# Altium schematic sheet MCU.SchDoc
size A; SheetNumber: 5; SheetTotal: 5
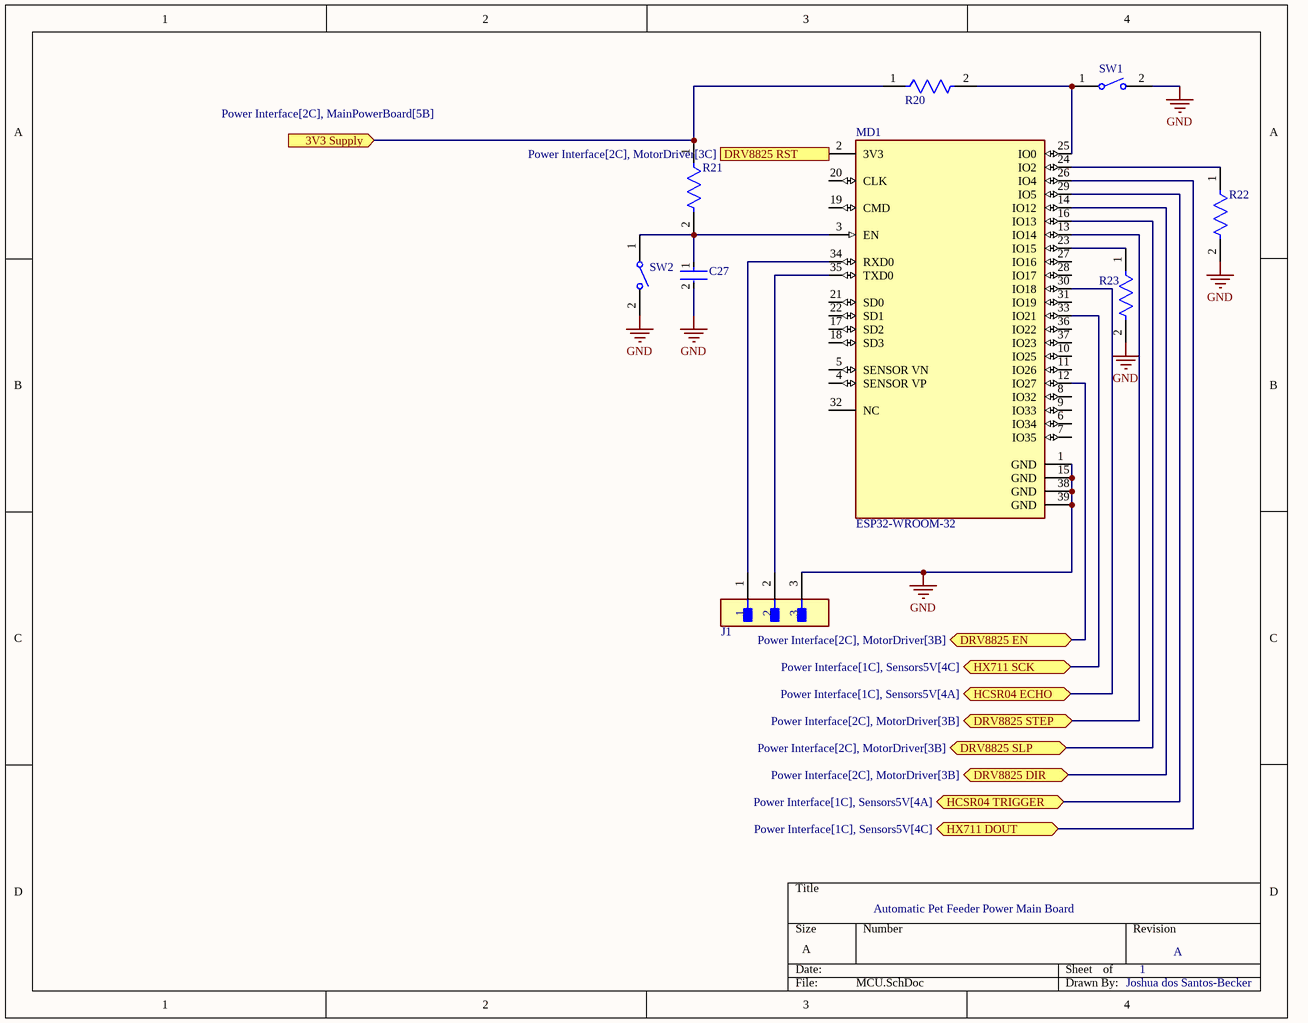
[diagram p0: MCU.SchDoc]

## Parts
C27  08055C104J4T2A  [FP-0805-L_2_01_0_2-W_1_25-MFG]  (value not drawn)
J1  PREC003SAAN-RC  [FP-PREC003SAAN-RC-MFG]  (value not drawn)
MD1  ESP32-WROOM-32  [FP-ESP32-WROOM-32-MFG]
R20  ESR10EZPD1002  [FP-ESR10-IPC_C]  (value not drawn)
R21  ESR10EZPD1002  [FP-ESR10-IPC_C]  (value not drawn)
R22  ESR10EZPD1002  [FP-ESR10-IPC_C]  (value not drawn)
R23  ESR10EZPD1002  [FP-ESR10-IPC_C]  (value not drawn)
SW1  FSMSM  [TECO-FSMSM-2_V]  (value not drawn)
SW2  FSMSM  [TECO-FSMSM-2_V]  (value not drawn)

## Ports
3V3 Supply (in, see Power Interface[2C], MainPowerBoard[5B]), DRV8825 DIR (bidir, see Power Interface[2C], MotorDriver[3B]), DRV8825 EN (bidir, see Power Interface[2C], MotorDriver[3B]), DRV8825 RST (see Power Interface[2C], MotorDriver[3C]), DRV8825 SLP (bidir, see Power Interface[2C], MotorDriver[3B]), DRV8825 STEP (bidir, see Power Interface[2C], MotorDriver[3B]), HCSR04 ECHO (bidir, see Power Interface[1C], Sensors5V[4A]), HCSR04 TRIGGER (bidir, see Power Interface[1C], Sensors5V[4A]), HX711 DOUT (bidir, see Power Interface[1C], Sensors5V[4C]), HX711 SCK (bidir, see Power Interface[1C], Sensors5V[4C])

## Nets
GND: C27.2 J1.3 MD1.1(GND) MD1.15(GND) MD1.38(GND) MD1.39(GND) R22.2 R23.2 SW1.2 SW2.2
3V3 Supply: R20.1 R21.1 ; port 3V3 Supply
DRV8825 DIR: MD1.14(IO12) ; port DRV8825 DIR
DRV8825 EN: MD1.12(IO27) ; port DRV8825 EN
DRV8825 RST: MD1.2(3V3) ; port DRV8825 RST
DRV8825 SLP: MD1.16(IO13) ; port DRV8825 SLP
DRV8825 STEP: MD1.13(IO14) ; port DRV8825 STEP
HCSR04 ECHO: MD1.30(IO18) ; port HCSR04 ECHO
HCSR04 TRIGGER: MD1.29(IO5) ; port HCSR04 TRIGGER
HX711 DOUT: MD1.26(IO4) ; port HX711 DOUT
HX711 SCK: MD1.33(IO21) ; port HX711 SCK
NetC27_1: C27.1 MD1.3(EN) R21.2 SW2.1
NetJ1_1: J1.1 MD1.34(RXD0)
NetJ1_2: J1.2 MD1.35(TXD0)
NetMD1_23: MD1.23(IO15) R23.1
NetMD1_24: MD1.24(IO2) R22.1
NetMD1_25: MD1.25(IO0) R20.2 SW1.1

Not connected (* = marked no-connect by the designer): MD1 4(SENSOR_VP) 5(SENSOR_VN) 6(IO34) 7(IO35) 8(IO32) 9(IO33) 10(IO25) 11(IO26) 17(SD2) 18(SD3) 19(CMD) 20(CLK) 21(SD0) 22(SD1) 27(IO16) 28(IO17) 31(IO19) 32(NC) 36(IO22) 37(IO23)

## Notes on the sheet
- Automatic Pet Feeder Power Main Board
- 1
- A
- Joshua dos Santos-Becker

## Library data of the parts
C27 = CMP-2007-04725-2: Automotive Ceramic Capacitor, 0805, 100nF, 5%, X7R, 15%, 50V; Dissipation Factor: 2.5%; Construction: Flat; Length: 2.01mm; Series: -; Tolerance: 5%; Number of Pins: 2; Termination: SMD/SMT; Packaging: Tape and Reel; Case/Package: 0805; Mount: Surface Mount; Depth: 1.25mm; Voltage Rating (DC): 50V; Package Quantity: 4000; RoHS Compliant: Yes; Ratings: AEC-Q200; Voltage Rating: 50V; Contact Plating: Tin; Width: 0.049inch; Height: 0.94mm; Dielectric: X7R; Case Code (Metric): 2012; Min Operating Temperature: -55°C; Lead Free: Lead Free; Radiation Hardening: No; Capacitance: 100nF; Thickness: 0.037inch; Max Operating Temperature: 125°C; Case Code (Imperial): 0805
J1 = CMP-00595-22265080-1: PREC003SAAN-RC Conn Header Vert 3POS 2.54MM; Number of Contacts: 3; Connector Type: Male Pin; Current Rating: 3A; Height: 8.74mm; Contact Mating Length: 5.842mm; Min Operating Temperature: -40°C; Termination: Solder; Packaging: Bulk; Pitch: 2.54mm; Color: Black; Mount: Through Hole; Contact Material: Nickel, Tin; Number of Rows: 1; NexarPartId: 22265080; Max Operating Temperature: 105°C; RoHS: Compliant; Contact Plating: Tin; Number of Positions: 3
MD1 = CMP-194065-000008-1: RX TXRX MOD WIFI SURFACE MOUNT; Frequency: 2.5GHz; Sensitivity: -98dBm; Operating Supply Voltage: 3.6V; Data Rate: 150Mbps; Weight: 0.088185oz; Package Quantity: 550; Min Operating Temperature: -40°C; Mount: Surface Mount; Max Operating Temperature: 85°C; Packaging: Cut Tape; Case/Package: SMD/SMT
R20-R23 = CMP-08839-028179-1: 10kΩ ±0.5% 0.4W 0805 Anti-Surge Chip Resistor AEC-Q200; RoHS Compliant: Yes
SW1 SW2 = CMP-2000-07511-1: FSMSM Push Button Switch, 50 mA, -35 to 85 degC, 2-Pin SMD, RoHS, Bulk; Manufacturer: TE Connectivity; Actuator Length: 1.07mm; Electrical Life: 20000Cycles; Actuator Material: Polyamide; Current Rating: 50mA; Illumination Type: Illuminated; Voltage Rating (DC): 24V; Contact Resistance: 100mOhm; Case\/Package: SMD/SMT; Operating Force: 180gf; Switch Travel: 0.25mm; Max Voltage Rating (DC): 12V; Throw Configuration: SPST; Packaging: LoosePiece; Max Operating Temperature: 85degC; ELV: Compliant; Package Description: 2-Pin Surface Mount Device, Body 6 x 3.5 mm, Pitch 9.19 mm; RoHSCompliant: true; Manufacturer URL: http://www.te.com/; Contact Plating: Silver; Contact Material: Brass; Mounting Technology: SurfaceMount; Contact Current Rating: 50mA; Datasheet Version: Rev. C2, 08/2014; Datasheet URL: http://www.te.com/commerce/DocumentDelivery/DDEController?Action=showdoc&DocId=Customer+Drawing%7F1437566-3%7FC2%7Fpdf%7FEnglish%7FENG_CD_1437566-3_C2_1437566_3_1_c.dwg.pdf%7F1437566-3; Mechanical Life: 20000Cycles; Package Reference: FSMSM; REACH SVHC: Unknown; Orientation: Straight; Min Operating Temperature: -35degC; Lead Free: LeadFree; Termination: GullWing; Package Quantity: 1000; Mount: SurfaceMount